# Altium project concentrator-868MHz.PrjPcb (part 1 of 2)
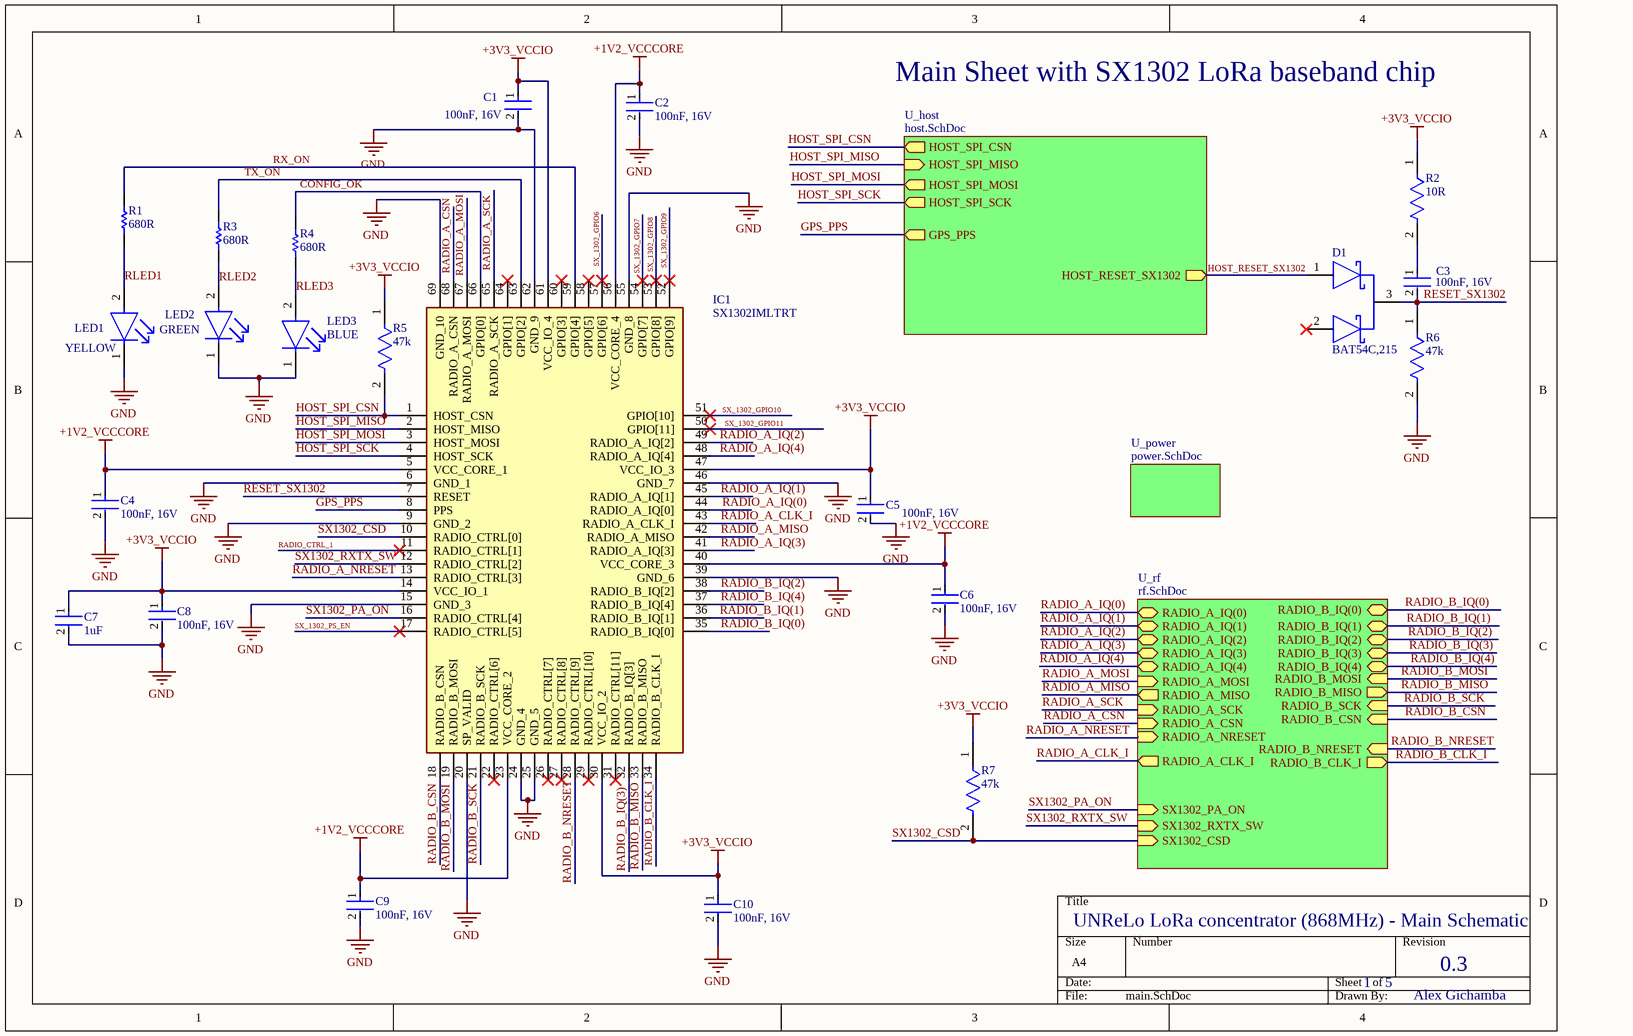
[diagram p0: main.SchDoc]
5 sheets, 112 parts. Net scope: hierarchical (ports join the sheet entries above them; power ports are global).
Board file: concentrator_pcb.PcbDoc
Sheets:
  main.SchDoc
    U_host = host.SchDoc
    U_rf = rf.SchDoc
      U_rf-fem = rf-fem.SchDoc
    U_power = power.SchDoc

## Sheet main.SchDoc
size A4; SheetNumber: 1; SheetTotal: 5

### Parts
C1  100nF, 16V  [FP-CC0603-DA-MFG]
C2  100nF, 16V  [FP-CC0603-DA-MFG]
C3  100nF, 16V  [FP-CC0603-DA-MFG]
C4  100nF, 16V  [FP-CC0603-DA-MFG]
C5  100nF, 16V  [FP-CC0603-DA-MFG]
C6  100nF, 16V  [FP-CC0603-DA-MFG]
C7  1uF  [FP-CL21-IPC_A]
C8  100nF, 16V  [FP-CC0603-DA-MFG]
C9  100nF, 16V  [FP-CC0603-DA-MFG]
C10  100nF, 16V  [FP-CC0603-DA-MFG]
D1  BAT54C,215  [FP-SOT23-MFG]
IC1  SX1302IMLTRT  [QFN35P700X700X80-69N-D]
LED1  YELLOW  [FP-SML-D12-MFG]
LED2  GREEN  [FP-LTST-C171GKT-MFG]
LED3  BLUE  [FP-6_541-5094_01-4-MFG]
R1  680R  [RESC2013X70X40ML20T20]
R2  10R  [FP-ERJ3EK-MFG]
R3  680R  [RESC2013X70X40ML20T20]
R4  680R  [RESC2013X70X40ML20T20]
R5  47k  [FP-RMCF0805-IPC_B]
R6  47k  [FP-RMCF0805-IPC_B]
R7  47k  [FP-RMCF0805-IPC_B]

### Sub-sheets
U_host = host.SchDoc: HOST_SPI_MOSI (out), HOST_SPI_MISO (in), HOST_SPI_CSN (out), HOST_SPI_SCK (out), HOST_RESET_SX1302 (out), GPS_PPS (out)
U_power = power.SchDoc: no entries
U_rf = rf.SchDoc: RADIO_A_IQ(0) (bidir), RADIO_A_IQ(1) (bidir), RADIO_A_IQ(4) (bidir), RADIO_A_IQ(3) (bidir), RADIO_A_IQ(2) (bidir), RADIO_B_IQ(2) (bidir), RADIO_B_IQ(4) (bidir), RADIO_B_IQ(1) (bidir), RADIO_B_IQ(0) (bidir), RADIO_B_IQ(3) (bidir), RADIO_A_SCK (in), RADIO_A_MOSI (in), RADIO_A_MISO (out), RADIO_A_NRESET (in), RADIO_A_CSN (in), RADIO_B_CSN (in), RADIO_B_SCK (in), RADIO_B_MOSI (in), RADIO_B_MISO (out), RADIO_B_NRESET (in), SX1302_CSD (in), SX1302_RXTX_SW (in), SX1302_PA_ON (in), RADIO_B_CLK_I (out), RADIO_A_CLK_I (out)

### Nets
+1V2_VCCCORE: C2.1 C4.1 C6.1 C9.1 IC1.5(VCC_CORE_1) IC1.23(VCC_CORE_2) IC1.40(VCC_CORE_3) IC1.56(VCC_CORE_4)
+3V3_VCCIO: C1.1 C5.1 C7.1 C8.1 C10.1 IC1.14(VCC_IO_1) IC1.30(VCC_IO_2) IC1.47(VCC_IO_3) IC1.61(VCC_IO_4) R2.1 R5.1 R7.1
GND: C1.2 C2.2 C4.2 C5.2 C6.2 C7.2 C8.2 C9.2 C10.2 IC1.6(GND_1) IC1.9(GND_2) IC1.15(GND_3) IC1.20(SP_VALID) IC1.24(GND_4) IC1.25(GND_5) IC1.39(GND_6) IC1.46(GND_7) IC1.55(GND_8) IC1.62(GND_9) IC1.69(GND_10) LED1.1(C) LED2.1(C) LED3.1(C) R6.2
CONFIG_OK: IC1.66(GPIO[0]) R4.2
GPS_PPS: IC1.8(PPS) ; sheet U_host/GPS_PPS
HOST_RESET_SX1302: D1.1(1_ANODE) ; sheet U_host/HOST_RESET_SX1302
HOST_SPI_CSN: IC1.1(HOST_CSN) R5.2 ; sheet U_host/HOST_SPI_CSN
HOST_SPI_MISO: IC1.2(HOST_MISO) ; sheet U_host/HOST_SPI_MISO
HOST_SPI_MOSI: IC1.3(HOST_MOSI) ; sheet U_host/HOST_SPI_MOSI
HOST_SPI_SCK: IC1.4(HOST_SCK) ; sheet U_host/HOST_SPI_SCK
RADIO_A_CLK_I: IC1.43(RADIO_A_CLK_I) ; sheet U_rf/RADIO_A_CLK_I
RADIO_A_CSN: IC1.68(RADIO_A_CSN) ; sheet U_rf/RADIO_A_CSN
RADIO_A_IQ(0): IC1.44(RADIO_A_IQ[0]) ; sheet U_rf/RADIO_A_IQ(0)
RADIO_A_IQ(1): IC1.45(RADIO_A_IQ[1]) ; sheet U_rf/RADIO_A_IQ(1)
RADIO_A_IQ(2): IC1.49(RADIO_A_IQ[2]) ; sheet U_rf/RADIO_A_IQ(2)
RADIO_A_IQ(3): IC1.41(RADIO_A_IQ[3]) ; sheet U_rf/RADIO_A_IQ(3)
RADIO_A_IQ(4): IC1.48(RADIO_A_IQ[4]) ; sheet U_rf/RADIO_A_IQ(4)
RADIO_A_MISO: IC1.42(RADIO_A_MISO) ; sheet U_rf/RADIO_A_MISO
RADIO_A_MOSI: IC1.67(RADIO_A_MOSI) ; sheet U_rf/RADIO_A_MOSI
RADIO_A_NRESET: IC1.13(RADIO_CTRL[3]) ; sheet U_rf/RADIO_A_NRESET
RADIO_A_SCK: IC1.65(RADIO_A_SCK) ; sheet U_rf/RADIO_A_SCK
RADIO_B_CLK_I: IC1.34(RADIO_B_CLK_I) ; sheet U_rf/RADIO_B_CLK_I
RADIO_B_CSN: IC1.18(RADIO_B_CSN) ; sheet U_rf/RADIO_B_CSN
RADIO_B_IQ(0): IC1.35(RADIO_B_IQ[0]) ; sheet U_rf/RADIO_B_IQ(0)
RADIO_B_IQ(1): IC1.36(RADIO_B_IQ[1]) ; sheet U_rf/RADIO_B_IQ(1)
RADIO_B_IQ(2): IC1.38(RADIO_B_IQ[2]) ; sheet U_rf/RADIO_B_IQ(2)
RADIO_B_IQ(3): IC1.32(RADIO_B_IQ[3]) ; sheet U_rf/RADIO_B_IQ(3)
RADIO_B_IQ(4): IC1.37(RADIO_B_IQ[4]) ; sheet U_rf/RADIO_B_IQ(4)
RADIO_B_MISO: IC1.33(RADIO_B_MISO) ; sheet U_rf/RADIO_B_MISO
RADIO_B_MOSI: IC1.19(RADIO_B_MOSI) ; sheet U_rf/RADIO_B_MOSI
RADIO_B_NRESET: IC1.28(RADIO_CTRL[9]) ; sheet U_rf/RADIO_B_NRESET
RADIO_B_SCK: IC1.21(RADIO_B_SCK) ; sheet U_rf/RADIO_B_SCK
RADIO_CTRL_1: IC1.11(RADIO_CTRL[1])
RESET_SX1302: C3.2 D1.3(COMMON_CATHODE) IC1.7(RESET) R6.1
RLED1: LED1.2(A) R1.1
RLED2: LED2.2(A) R3.1
RLED3: LED3.2(A) R4.1
RX_ON: IC1.59(GPIO[4]) R1.2
SX1302_CSD: IC1.10(RADIO_CTRL[0]) R7.2 ; sheet U_rf/SX1302_CSD
SX1302_PA_ON: IC1.16(RADIO_CTRL[4]) ; sheet U_rf/SX1302_PA_ON
SX1302_RXTX_SW: IC1.12(RADIO_CTRL[2]) ; sheet U_rf/SX1302_RXTX_SW
SX_1302_GPIO6: IC1.57(GPIO[6])
SX_1302_GPIO7: IC1.54(GPIO[7])
SX_1302_GPIO8: IC1.53(GPIO[8])
SX_1302_GPIO9: IC1.52(GPIO[9])
SX_1302_GPIO10: IC1.51(GPIO[10])
SX_1302_GPIO11: IC1.50(GPIO[11])
SX_1302_PS_EN: IC1.17(RADIO_CTRL[5])
TX_ON: IC1.63(GPIO[2]) R3.2
NetC3_1: C3.1 R2.2

Not connected (* = marked no-connect by the designer): D1 2(2_ANODE)*; IC1 22(RADIO_CTRL[6])* 26(RADIO_CTRL[7])* 27(RADIO_CTRL[8])* 29(RADIO_CTRL[10])* 31(RADIO_CTRL[11])* 58(GPIO[5])* 60(GPIO[3])* 64(GPIO[1])*

### Notes on the sheet
- Main Sheet with SX1302 LoRa baseband chip
- UNReLo LoRa concentrator (868MHz) - Main Schematic
- 1
- 5
- 0.3
- Alex Gichamba

### Library data of the parts
C1-C6 C8-C10 = CMP-2100-03601-2: CAP CER 0.1UF 50V X7R 0603; Manufacturer: YAGEO; Manufacturer Part Number: CC0603KRX7R9BB104; Material: Ceramic; Temperature Coefficient: 15%; Tolerance: 0.1; Height: 0.9mm; Voltage: 50 V; ComponentLink2Description: Datasheet; Device Class L2: Capacitors; Temperature Range High: +125°C; Category: Cap; Capacitance: 100 nF; Footprint Url: http://www.yageo.com/exep/pages/download/literatures/UPY-C_GEN_24.pdf; ComponentLink2URL: http://www.yageo.com/documents/recent/UPY-GPHC_X7R_6.3V-to-50V_18.pdf; Package: CC0603-DA; Temperature: -55°C to +125°C; Voltage Rating: 50 V; Temperature Characteristic: X7R; Device Class L1: Passive Components; Temperature Range Low: -55°C; RoHS: TRUE; Automotive: No; Value: 100 nF; Device Class L3: Ceramic Capacitors; Octopart: https://octopart.com/cc0603krx7r9bb104-yageo-42244635; Mouser Description: Multilayer Ceramic Capacitor, CC Series, 0.1 - F, - 10%, X7R, 50 V, 0603 [1608 Metric]; Lead Free: Yes; Digikey Description: CAP CER 0.1UF 50V X7R 0603
C7 = CMP-13271-003098-1: CL21 Series 0805 1uF 16V ±10% Tolerance X7R Multilayer Ceramic Chip Capacitor; Case Code (Metric): 2012; Width: 0.049inch; Thickness: 0.053inch; Voltage Rating: 16V; Max Operating Temperature: 125°C; Case Code (Imperial): 0805; Height: 1.25mm; Length: 2mm; Case/Package: 0805; Lead Free: Lead Free; Mount: Surface Mount; Capacitance: 1uF; Tolerance: 10%; Voltage Rating (DC): 16V; Min Operating Temperature: -55°C; Contact Plating: Tin; Depth: 1.25mm; Packaging: Tape and Reel; Package Quantity: 1; Voltage: 16V; Dielectric: X7R; Radiation Hardening: No
D1 = CMP-14398-000007-1: DIODE ARRAY SCHOTTKY 30V SOT23; Manufacturer: Nexperia; Automotive Grade: Grade 0; Peak Reverse Current: 2uA; Forward Current: 200mA; Max Surge Forward Current: 600mA; Value: 10pF; Max Junction Temp: +150°C; Lead Free: Yes; Automotive: Yes; Device Class L1: Discrete Semiconductors; Digikey Description: DIODE ARRAY SCHOTTKY 30V SOT23; Reverse Voltage: 30V; ComponentLink2URL: https://assets.nexperia.com/documents/data-sheet/BAT54_SER.pdf; Device Class L2: Diodes; Category: Diode; Octopart: https://octopart.com/bat54c%2C215-nexperia-78738945; Package: SOT23; Mouser Description: Schottky Diodes, Rectifiers - Arrays SOT-23 (TO-236AB) 30V 200mA (DC) Surface Mount; RoHS: TRUE; Manufacturer Part Number: BAT54C,215; Temperature: to +150°C; Ambient Temperature Range Low: -55°C; Height: 1.1mm; Device Class L3: Schottky Diodes; Temperature Range High: +150°C; Footprint Url: https://assets.nexperia.com/documents/outline-drawing/SOT23.pdf; Capacitance: 10pF; Ambient Temperature Range High: +150°C; Ipc Land Pattern Name: SOT95P230X100-3; ComponentLink2Description: Datasheet
IC1 = CMP-009-000004-1: Integrated Circuit; Manufacturer_Name: SEMTECH; Mouser Part Number: 947-SX1302IMLTRT; Datasheet Link: https://datasheet.datasheetarchive.com/originals/distributors/Datasheets_SAMA/c18cc298abe30af156b2783e16147acc.pdf; Design Item ID: SX1302IMLTRT; Mouser Price/Stock: https://www.mouser.co.uk/ProductDetail/Semtech/SX1302IMLTRT?qs=bZr6mbWTK5nALa%252B96PTK0Q%3D%3D; Height: 0.8mm; Component Type: Standard; Pin Count: 69; Source: SamacSys.SchLib; Manufacturer_Part_Number: SX1302IMLTRT
LED1 = CMP-08952-000005-1: LED YLW/GREEN DIFFUSED 1608 SMD; Manufacturer Part Number: SML-D12M1WT86; Manufacturer: Rohm; Led Orientation: Top View; Forward Voltage: 2.2V; Power Dissipation: 54mW; Wavelength: 572nm; Colour: Green; Reverse Voltage: 5V; Forward Current: 20mA; Luminous Intensity: 30mcd; RoHS: TRUE; Package: SML-D12; Temperature Range Low: -40°C; Device Class L3: unset; Temperature Range High: +85°C; Device Class L2: LEDs; Category: Diode; Device Class L1: Optoelectronics; Digikey Description: LED YLW/GREEN DIFFUSED 1608 SMD; Temperature: -40°C to +85°C; ComponentLink2Description: Datasheet; Automotive: No; Height: 0.65mm; Lead Free: Yes; Octopart: https://octopart.com/sml-d12m1wt86-rohm-70837112; ComponentLink2URL: https://www.rohm.com/datasheet/SML-D12M1W
LED2 = CMP-22017-000007-1: LED GREEN CLEAR CHIP SMD; Luminous Intensity: 12mcd; Lens Color: Colorless; Dominant Wavelength: 569nm; Number of LEDs: 1; Power Dissipation: 100mW; Viewing Angle: 130°; Reverse Voltage: 5V; Test Current: 10mA; Forward Voltage: 2.1V; Wavelength: 585nm; Lens Style: Diffused; Forward Current: 30mA; Height: 0.8mm; Mount: Surface Mount; Package Quantity: 1; Length: 2mm; Case Code (Metric): 2012; Number of Pins: 2; Number of Elements: 1; Packaging: Tape and Reel; Color: Green; Min Operating Temperature: -55°C; Case/Package: 0805; Power Rating: 100mW; Max Operating Temperature: 85°C; Radiation Hardening: No; Depth: 1.25mm; Lens Transparency: Clear; Width: 1.25mm; Lead Free: Lead Free; Case Code (Imperial): 0805; Illumination Color: Green
LED3 = CMP-02520-000013-1: LED BLUE 0603 SMD; Manufacturer Part Number: VLMB1300-GS08; Manufacturer: Vishay Semiconductor Opto Division; Forward Current: 20mA; Wavelength: 475nm; Viewing Angle: 130°; Forward Voltage: 3.8V; Power Dissipation: 76mW; Luminous Intensity: 28-180mcd; Led Orientation: Top View; Peak Emmision Wavelength: 468nm; RoHS: TRUE; ComponentLink2URL: http://www.vishay.com/docs/82437/vlmo1300.pdf; Ambient Temperature Range Low: -20°C; ComponentLink2Description: Datasheet; Mouser Description: LED; SMD; 0603; blue; 28-180mcd; 1.6x0.8x0.8mm; 130°; 2.8÷3.8V; 20mA; Package: 6.541-5094.01-4; Device Class L3: unset; Automotive: No; Temperature: -20°C to +80°C; Colour: Blue; Digikey Description: LED BLUE 0603 SMD; Device Class L2: LEDs; Temperature Range Low: -20°C; Lead Free: Yes; Category: Diode; Device Class L1: Optoelectronics; Height: 1mm; Octopart: https://octopart.com/vlmb1300-gs08-vishay-22022408; Temperature Range High: +80°C; Ambient Temperature Range High: +80°C
R1 R3 R4 = CMP-2001-00566-1: Part Number: ERJ6ENF6800V; Manufacturer: Panasonic
R2 = CMP-2000-00195-2: RES SMD 10 OHM 1% 1/10W 0603; Manufacturer Part Number: ERJ-3EKF10R0V; Manufacturer: Panasonic; Resistance: 10Ω; Voltage Rating: 75V; Value: 10Ω; Power: 100mW; Power Rating: 0.1W; Temperature Coefficient: 100ppm/°C; Automotive Grade: Grade 0; Lead Free: Yes; Device Class L1: Passive Components; Digikey Description: RES SMD 10 OHM 1% 1/10W 0603; Octopart: https://octopart.com/erj-3ekf10r0v-panasonic-55403649; Automotive: Yes; ComponentLink2URL: https://b2b-api.panasonic.eu/file_stream/pids/fileversion/1263; Height: 0.55mm; Temperature Range High: +155°C; Footprint Url: https://industrial.panasonic.com/cdbs/www-data/pdf/RDA0000/DMA0000COL17.pdf; Temperature: -55°C to +155°C; Tolerance: 1%; ComponentLink2Description: Datasheet; Package: ERJ3EK; Device Class L2: Resistors; Category: Res; Ipc Land Pattern Name: RESC16080X45; RoHS: TRUE; Composition: Thick Film; Device Class L3: Chip SMD Resistors; Temperature Range Low: -55°C; Series: ERJ
R5-R7 = CMP-26527-006464-1: 47kΩ ±5% 0.125W 0805 Thick Film Chip Resistor AEC-Q200 compliant; Power Rating: 125mW; Working Voltage: 150V; Temperature Coefficient: 100ppm/°C; Resistance: 47kR; Length: 2mm; Max Operating Temperature: 155°C; Case Code (Imperial): 0805; Min Operating Temperature: -55°C; Radiation Hardening: No; Tolerance: 5%; Number of Terminations: 2; Technology: THICK FILM; Military Standard: Not; Max Power Dissipation: 125mW; RoHS Compliant: Yes; Case/Package: 0805; Mount: Surface Mount; Resistor Type: Thick Film; Packaging: Tape and Reel; Lead Free: Lead Free; Depth: 1.25mm; Width: 0.049inch; Case Code (Metric): 2012; Height: 0.026inch; Contact Plating: Tin; Construction: Rectangular; Series: RMCF; Features: Automotive AEC-Q200

## Sheet host.SchDoc
size A4; SheetNumber: 4; SheetTotal: 5
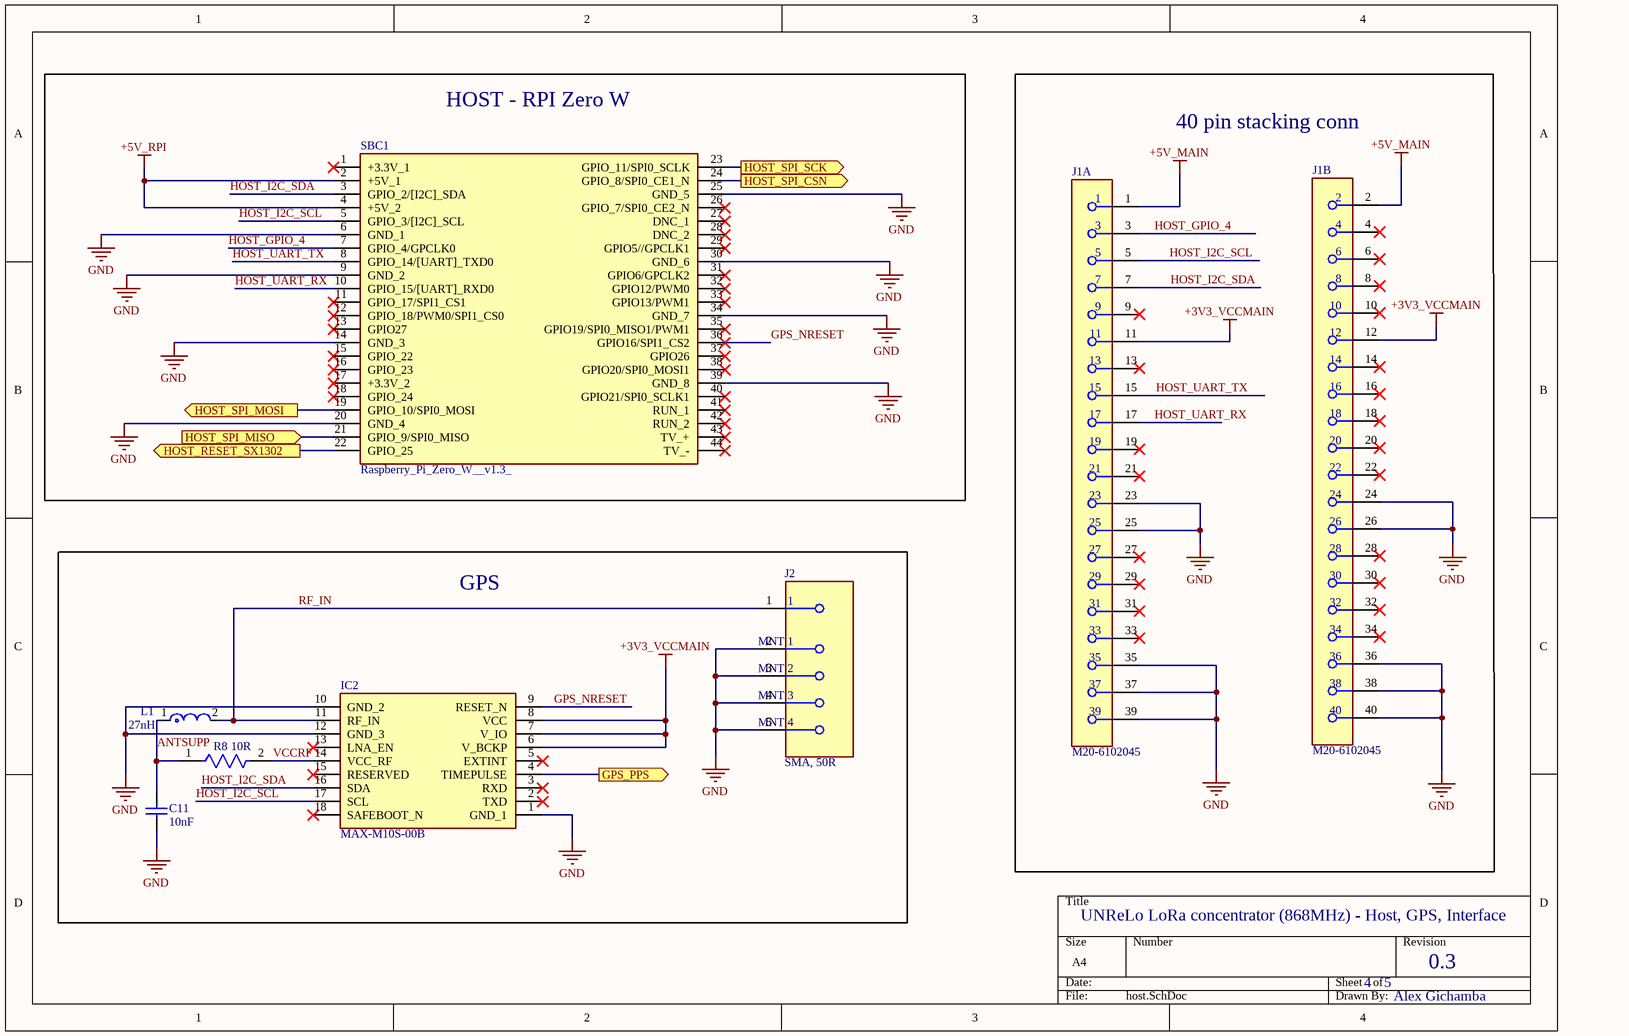
[diagram p1: host.SchDoc]

### Parts
C11  10nF  [CAPC1608X90X35NL15T15]
IC2  MAX-M10S-00B  [MAXM10S00B]
J1  M20-6102045  [FP-M20-6102045-MFG]  (parts A,B of 2)
J2  SMA, 50R  [FP-SMA-J-P-H-ST-EM1-MFG]
L1  27nH  [FP-LQG15HH_02-IPC_C]
R8  10R  [FP-ERJ3EK-MFG]
SBC1  Raspberry_Pi_Zero_W__v1.3_  [RASPBERRYPIZEROWV13]

### Blocks framed on the sheet
HOST - RPI Zero W: SBC1
40 pin stacking conn: J1
GPS: C11 IC2 J2 L1 R8

### Ports
GPS_PPS (out), HOST_RESET_SX1302 (out), HOST_SPI_CSN (out), HOST_SPI_MISO (in), HOST_SPI_MOSI (out), HOST_SPI_SCK (out)

### Nets
+3V3_VCCMAIN: IC2.6(V_BCKP) IC2.7(V_IO) IC2.8(VCC) J1.11 J1.12
+5V_MAIN: J1.1 J1.2
+5V_RPI: SBC1.2(+5V_1) SBC1.4(+5V_2)
GND: C11.1 IC2.1(GND_1) IC2.10(GND_2) IC2.12(GND_3) J1.23 J1.24 J1.25 J1.26 J1.35 J1.36 J1.37 J1.38 J1.39 J1.40 J2.2(MNT_1) J2.3(MNT_2) J2.4(MNT_3) J2.5(MNT_4) SBC1.6(GND_1) SBC1.9(GND_2) SBC1.14(GND_3) SBC1.20(GND_4) SBC1.25(GND_5) SBC1.30(GND_6) SBC1.34(GND_7) SBC1.39(GND_8)
ANTSUPP: C11.2 L1.1 R8.1
GPS_NRESET: IC2.9(RESET_N) SBC1.36(GPIO16/SPI1_CS2)
GPS_PPS: IC2.4(TIMEPULSE) ; port GPS_PPS
HOST_GPIO_4: J1.3 SBC1.7(GPIO_4/GPCLK0)
HOST_I2C_SCL: IC2.17(SCL) J1.5 SBC1.5(GPIO_3/[I2C]_SCL)
HOST_I2C_SDA: IC2.16(SDA) J1.7 SBC1.3(GPIO_2/[I2C]_SDA)
HOST_RESET_SX1302: SBC1.22(GPIO_25) ; port HOST_RESET_SX1302
HOST_SPI_CSN: SBC1.24(GPIO_8/SPI0_CE1_N) ; port HOST_SPI_CSN
HOST_SPI_MISO: SBC1.21(GPIO_9/SPI0_MISO) ; port HOST_SPI_MISO
HOST_SPI_MOSI: SBC1.19(GPIO_10/SPI0_MOSI) ; port HOST_SPI_MOSI
HOST_SPI_SCK: SBC1.23(GPIO_11/SPI0_SCLK) ; port HOST_SPI_SCK
HOST_UART_RX: J1.17 SBC1.10(GPIO_15/[UART]_RXD0)
HOST_UART_TX: J1.15 SBC1.8(GPIO_14/[UART]_TXD0)
RF_IN: IC2.11(RF_IN) J2.1 L1.2
VCCRF: IC2.14(VCC_RF) R8.2

Not connected (* = marked no-connect by the designer): IC2 2(TXD)* 3(RXD)* 5(EXTINT)* 13(LNA_EN)* 15(RESERVED)* 18(SAFEBOOT_N)*; J1 4* 6* 8* 9* 10* 13* 14* 16* 18* 19* 20* 21* 22* 27* 28* 29* 30* 31* 32* 33* 34*; SBC1 1(+3.3V_1)* 11(GPIO_17/SPI1_CS1)* 12(GPIO_18/PWM0/SPI1_CS0)* 13(GPIO27)* 15(GPIO_22)* 16(GPIO_23)* 17(+3.3V_2)* 18(GPIO_24)* 26(GPIO_7/SPI0_CE2_N)* 27(DNC_1)* 28(DNC_2)* 29(GPIO5//GPCLK1)* 31(GPIO6/GPCLK2)* 32(GPIO12/PWM0)* 33(GPIO13/PWM1)* 35(GPIO19/SPI0_MISO1/PWM1)* 37(GPIO26)* 38(GPIO20/SPI0_MOSI1)* 40(GPIO21/SPI0_SCLK1)* 41(RUN_1)* 42(RUN_2)* 43(TV_+)* 44(TV_-)*

### Notes on the sheet
- UNReLo LoRa concentrator (868MHz) - Host, GPS, Interface
- 4
- 5
- 0.3
- Alex Gichamba

### Library data of the parts
C11 = CMP-2006-02084-1: Manufacturer: AVX Interconnect / Elco; Part Number: 0603YC103JAT2A
IC2 = MAX-M10S-00B: Integrated Circuit; Manufacturer_Name: U-Blox; Datasheet Link: https://content.u-blox.com/sites/default/files/MAX-M10S_IntegrationManual_UBX-20053088.pdf; Height: 2.7mm; Manufacturer_Part_Number: MAX-M10S-00B; Mouser Part Number: 377-MAX-M10S-00B; Mouser Price/Stock: https://www.mouser.co.uk/ProductDetail/u-blox/MAX-M10S-00B?qs=A6eO%252BMLsxmT0PfQYPb7LLQ%3D%3D
J1 = CMP-15831-000080-1: CONN STKTHRU PC/104 40POS PCB; Current Rating: 3A; Pitch: 2.54mm; Insulation Resistance: 5GR; Contact Resistance: 30mR; Number of Positions: 40; Gender: Receptacle; REACH SVHC: No SVHC; Housing Material: Nylon; Number of Rows: 2; Min Operating Temperature: -55°C; Contact Plating: Gold; Orientation: Straight; Mount: Through Hole; Contact Material: Bronze; Length: 51.46mm; Weight: 0.218205oz; Number of Contacts: 40; Packaging: Rail/Tube; Depth: 5.25mm; Termination: Solder; Radiation Hardening: No; Flammability Rating: UL94 V-0; Housing Color: Black; Max Operating Temperature: 105°C; Material: Nylon; Package Quantity: 11; Color: Black; Max Current Rating: 3A; Series: M20
J2 = CMP-02754-000006-1: CONN SMA JACK STR 50OHM EDGE MNT; Dielectric Material: PTFE; Center Contact Plating: Gold; Max Frequency: 6GHz; Body Material: Brass; Voltage Rating: 335V; Package Quantity: 1; Case/Package: SMA; Max Operating Temperature: 125°C; Fastening Type: Threaded; Orientation: Straight; Depth: 13.33mm; RoHS Compliant: Yes; Length: 6.35mm; Insulation Material: Polytetrafluoroethylene; Termination: Solder; Min Operating Temperature: -65°C; Housing Color: Gold; Impedance: 50R; Contact Plating: Gold; Contact Material: Copper; Connector Type: SMA; Mount: Edge; Series: SMA; Packaging: Tray; Body Plating: Gold; Radiation Hardening: No
L1 = CMP-2000-06578-2: Multilayer type RF Inductor 27nH ±5% 0.46Ω 350mA 0402; DC Current: 300mA; Core Material: Air; Self Resonant Frequency: 1.7GHz; Q Factor: 8; DC Resistance (DCR): 460mR; Shielding: Unshielded; Test Frequency: 100MHz; Inductance: 27nH; Width: 0.02inch; Length: 1mm; Height - Seated (Max): 0.022inch; Military Standard: Not; Case Code (Imperial): 0402; Tolerance: 5%; Depth: 0.55mm; Current Rating: 300mA; Inductance Tolerance: 5%; Lead Free: Lead Free; Height: 0.5mm; Max DC Current: 300mA; REACH SVHC: No SVHC; Package Quantity: 10000; Mount: Surface Mount; Termination: SMD/SMT; Case Code (Metric): 1005; Case/Package: 0402; Max Operating Temperature: 125°C; Packaging: Tape and Reel; Min Operating Temperature: -55°C
R8 = CMP-2000-00195-2: as R2 on sheet main; Lead Free: Yes; Device Class L1: Passive Components; Digikey Description: RES SMD 10 OHM 1% 1/10W 0603; Octopart: https://octopart.com/erj-3ekf10r0v-panasonic-55403649; Automotive: Yes; ComponentLink2URL: https://b2b-api.panasonic.eu/file_stream/pids/fileversion/1263; Height: 0.55mm; Temperature Range High: +155°C; Footprint Url: https://industrial.panasonic.com/cdbs/www-data/pdf/RDA0000/DMA0000COL17.pdf; Temperature: -55°C to +155°C; Tolerance: 1%; ComponentLink2Description: Datasheet; Package: ERJ3EK; Device Class L2: Resistors; Category: Res; Ipc Land Pattern Name: RESC16080X45; RoHS: TRUE; Composition: Thick Film; Device Class L3: Chip SMD Resistors; Temperature Range Low: -55°C; Series: ERJ
SBC1 = Raspberry_Pi_Zero_W__v1.3_: Integrated Circuit; Manufacturer_Name: RASPBERRY-PI; Manufacturer_Part_Number: Raspberry Pi Zero W (v1.3); Datasheet Link: https://cdn.sparkfun.com/assets/learn_tutorials/6/7/6/PiZero_1.pdf

## Sheet rf.SchDoc
size A4; SheetNumber: 2; SheetTotal: 5; SPICEModelCacheDZKFQWXO: <root> / <DocumentId>DZKFQWXO</DocumentId> / <CacheFrame Number="0"> / <Model Name="gmk107b7474_aht" Kind="CKT"> / <Text>* GMK107B7474_AHT     SPICE MODEL  ( General Type ) / *-------------------------------------------------------------------------------------------------------- / * Model Generated by TAIYO YUDEN Corporation (http://www.ty-top.com) / * Version 1.0 / * TAIYO YUDEN Control No. 170508_121019 / * Copyright(c) 2012 TAIYO YUDEN CO.,LTD. All Rights Reserved. / *-------------------------------------------------------------------------------------------------------- / * / * Products Name : Multilayer Ceramic Capacitors / * / * Characteristics : / *     Capacitance : 0.47 uF , Rated Voltage : 35V , TCC : X7R / *     Case Size : 1.6 x 0.8 / 0.063 x 0.031 [mm/inch] , Thickness : 0.8 / 0.031 [mm/inch] / *     (Conditions: Temperature = 25 degC , DC Bias Current/Voltage = 0A / 0V) / * / * Frequency Range : 40Hz - 3GHz / * / * External Node Assignments : / * / *  1  o---| |---o  2 / * / *-------------------------------------------------------------------------------------------------------- / .SubCkt GMK107B7474_AHT 1 2 / **************************** / C0 1 110 0.35241u / Cm 1 101 0.045967u / C1 101 102 0.1128u / Rc1 101 102 7.0157k / C2 102 103 0.052259u / Rc2 102 103 650.62 / C3 103 110 0.038908u / Rc3 103 110 33.924 / C2m 1 301 0.059177u / C21 301 302 0.20596u / Rc21 301 302 18.494k / C22 302 303 0.3392u / Rc22 302 303 11.168k / C23 303 304 0.29488u / Rc23 303 304 12.333k / C24 304 305 0.15174u / Rc24 304 305 1.1874k / C25 305 306 0.15169u / Rc25 305 306 1.0968k / C26 306 307 0.081575u / Rc26 306 307 73.58 / C27 307 308 0.067021u / Rc27 307 308 74.754 / C28 308 309 0.057362u / Rc28 308 309 86.716 / C29 309 110 3917.4p / Rc29 309 110 14.273 / Rp0 1 110 1.06382978723404G / L0 110 120 0.25665n / Lm 120 130 0.18492n / L1 120 121 0.15921n / RL1 121 130 0.10518 / L2 120 122 1.1975n / RL2 122 130 0.76936 / L3 120 123 2.5752n / RL3 123 130 1.6537 / CR 120 124 0.034572u / LR 124 125 0.3441n / RR 125 130 93.45m / CL 130 140 1.8662p / LL 130 140 0.25845n / RL 130 140 37.948 / Rs 140 2 10.204m / **************************** / .ends GMK107B7474_AHT</Text> / </Model> / </CacheFrame> / </root>
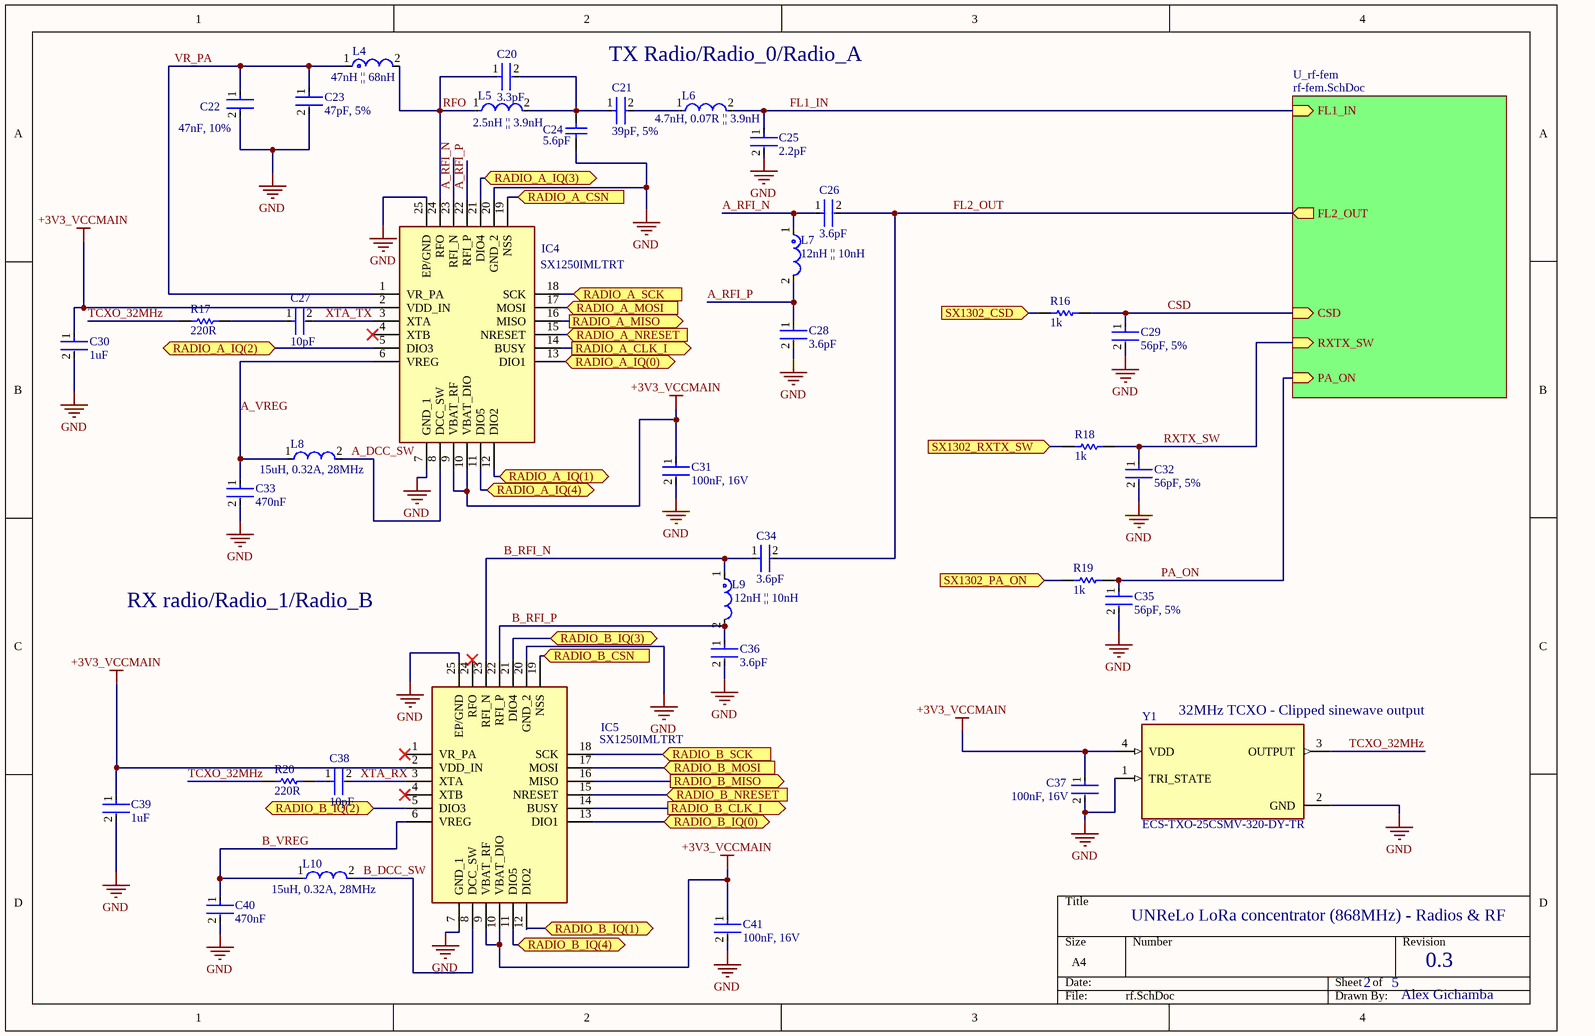
[diagram p2: rf.SchDoc]

### Parts
C20  3.3pF  [FP-GQM187-0_15-MFG]
C21  39pF, 5%  [FP-CL10-IPC_B]
C22  47nF, 10%  [FP-CL10-IPC_A]
C23  47pF, 5%  [FP-0603-L_1_6_0_15-W_0_81-MFG]
C24  5.6pF  [CAPC1608X90X35ML10T15]
C25  2.2pF  [FP-CL764-IPC_C]
C26  3.6pF  [FP-GJM155-0_05-IPC_C]
C27  10pF  [FP-CL10-IPC_A]
C28  3.6pF  [FP-GJM155-0_05-IPC_C]
C29  56pF, 5%  [FP-GCM188-0_1-IPC_A]
C30  1uF  [FP-CL21-IPC_A]
C31  100nF, 16V  [FP-CC0603-DA-MFG]
C32  56pF, 5%  [FP-GCM188-0_1-IPC_A]
C33  470nF  [FP-0603-L_1_6_0_1-W_0_8_0-IPC_A]
C34  3.6pF  [FP-GJM155-0_05-IPC_C]
C35  56pF, 5%  [FP-GCM188-0_1-IPC_A]
C36  3.6pF  [FP-GJM155-0_05-IPC_C]
C37  100nF, 16V  [FP-CC0603-DA-MFG]
C38  10pF  [FP-CL10-IPC_A]
C39  1uF  [FP-CL21-IPC_A]
C40  470nF  [FP-0603-L_1_6_0_1-W_0_8_0-IPC_A]
C41  100nF, 16V  [FP-CC0603-DA-MFG]
IC4  SX1250IMLTRT  [QFN50P400X400X100-25N-D]
IC5  SX1250IMLTRT  [QFN50P400X400X100-25N-D]
L4  47nH || 68nH  [FP-LQG18HH_00-MFG]
L5  2.5nH || 3.9nH  [FP-LQW15AN_00-W0_6-0_1-MFG]
L6  4.7nH, 0.07R || 3.9nH  [FP-LQW15AN_00-W0_6-0_1-MFG]
L7  12nH || 10nH  [FP-LQG15HH_02-IPC_A]
L8  15uH, 0.32A, 28MHz  [FP-CB2012-MFG]
L9  12nH || 10nH  [FP-LQG15HH_02-IPC_A]
L10  15uH, 0.32A, 28MHz  [FP-CB2012-MFG]
R16  1k  [RESC2013X70X40ML20T20]
R17  220R  [RESC1608X55X30LL15T15]
R18  1k  [RESC2013X70X40ML20T20]
R19  1k  [RESC2013X70X40ML20T20]
R20  220R  [RESC1608X55X30LL15T15]
Y1  ECS-TXO-25CSMV-320-DY-TR  [OSC_ECS-TXO-25CSMV-320-DY-TR]

### Sub-sheets
U_rf-fem = rf-fem.SchDoc: CSD (in), PA_ON (in), RXTX_SW (in), FL1_IN (in), FL2_OUT (out)

### Ports
RADIO_A_CLK_I (out), RADIO_A_CSN (in), RADIO_A_IQ(0) (bidir), RADIO_A_IQ(1) (bidir), RADIO_A_IQ(2) (bidir), RADIO_A_IQ(3) (bidir), RADIO_A_IQ(4) (bidir), RADIO_A_MISO (out), RADIO_A_MOSI (in), RADIO_A_NRESET (in), RADIO_A_SCK (in), RADIO_B_CLK_I (out), RADIO_B_CSN (in), RADIO_B_IQ(0) (bidir), RADIO_B_IQ(1) (bidir), RADIO_B_IQ(2) (bidir), RADIO_B_IQ(3) (bidir), RADIO_B_IQ(4) (bidir), RADIO_B_MISO (out), RADIO_B_MOSI (in), RADIO_B_NRESET (in), RADIO_B_SCK (in), SX1302_CSD (in), SX1302_PA_ON (in), SX1302_RXTX_SW (in)

### Nets
+3V3_VCCMAIN: C30.1 C31.1 C37.1 C39.1 C41.1 IC4.2(VDD_IN) IC4.9(VBAT_RF) IC4.10(VBAT_DIO) IC5.2(VDD_IN) IC5.9(VBAT_RF) IC5.10(VBAT_DIO) Y1.4(VDD)
GND: C22.2 C23.2 C24.1 C25.2 C28.2 C29.2 C30.2 C31.2 C32.2 C33.2 C35.2 C36.2 C37.2 C39.2 C40.2 C41.2 IC4.7(GND_1) IC4.20(GND_2) IC4.25(EP/GND) IC5.7(GND_1) IC5.20(GND_2) IC5.25(EP/GND) Y1.1(TRI_STATE) Y1.2(GND)
A_DCC_SW: IC4.8(DCC_SW) L8.2
A_RFI_N: C26.1 IC4.23(RFI_N) L7.1
A_RFI_P: C28.1 IC4.22(RFI_P) L7.2
A_VREG: C33.1 IC4.6(VREG) L8.1
B_DCC_SW: IC5.8(DCC_SW) L10.2
B_RFI_N: C34.1 IC5.23(RFI_N) L9.1
B_RFI_P: C36.1 IC5.22(RFI_P) L9.2
B_VREG: C40.1 IC5.6(VREG) L10.1
CSD: C29.1 R16.2 ; sheet U_rf-fem/CSD
FL1_IN: C25.1 L6.2 ; sheet U_rf-fem/FL1_IN
FL2_OUT: C26.2 C34.2 ; sheet U_rf-fem/FL2_OUT
PA_ON: C35.1 R19.2 ; sheet U_rf-fem/PA_ON
RADIO_A_CLK_I: IC4.14(BUSY) ; port RADIO_A_CLK_I
RADIO_A_CSN: IC4.19(NSS) ; port RADIO_A_CSN
RADIO_A_IQ(0): IC4.13(DIO1) ; port RADIO_A_IQ(0)
RADIO_A_IQ(1): IC4.12(DIO2) ; port RADIO_A_IQ(1)
RADIO_A_IQ(2): IC4.5(DIO3) ; port RADIO_A_IQ(2)
RADIO_A_IQ(3): IC4.21(DIO4) ; port RADIO_A_IQ(3)
RADIO_A_IQ(4): IC4.11(DIO5) ; port RADIO_A_IQ(4)
RADIO_A_MISO: IC4.16(MISO) ; port RADIO_A_MISO
RADIO_A_MOSI: IC4.17(MOSI) ; port RADIO_A_MOSI
RADIO_A_NRESET: IC4.15(NRESET) ; port RADIO_A_NRESET
RADIO_A_SCK: IC4.18(SCK) ; port RADIO_A_SCK
RADIO_B_CLK_I: IC5.14(BUSY) ; port RADIO_B_CLK_I
RADIO_B_CSN: IC5.19(NSS) ; port RADIO_B_CSN
RADIO_B_IQ(0): IC5.13(DIO1) ; port RADIO_B_IQ(0)
RADIO_B_IQ(1): IC5.12(DIO2) ; port RADIO_B_IQ(1)
RADIO_B_IQ(2): IC5.5(DIO3) ; port RADIO_B_IQ(2)
RADIO_B_IQ(3): IC5.21(DIO4) ; port RADIO_B_IQ(3)
RADIO_B_IQ(4): IC5.11(DIO5) ; port RADIO_B_IQ(4)
RADIO_B_MISO: IC5.16(MISO) ; port RADIO_B_MISO
RADIO_B_MOSI: IC5.17(MOSI) ; port RADIO_B_MOSI
RADIO_B_NRESET: IC5.15(NRESET) ; port RADIO_B_NRESET
RADIO_B_SCK: IC5.18(SCK) ; port RADIO_B_SCK
RFO: C20.1 IC4.24(RFO) L4.2 L5.1
RXTX_SW: C32.1 R18.2 ; sheet U_rf-fem/RXTX_SW
SX1302_CSD: R16.1 ; port SX1302_CSD
SX1302_PA_ON: R19.1 ; port SX1302_PA_ON
SX1302_RXTX_SW: R18.1 ; port SX1302_RXTX_SW
TCXO_32MHz: R17.1 R20.1 Y1.3(OUTPUT)
VR_PA: C22.1 C23.1 IC4.1(VR_PA) L4.1
XTA_RX: C38.2 IC5.3(XTA)
XTA_TX: C27.2 IC4.3(XTA)
NetC20_2: C20.2 C21.1 C24.2 L5.2
NetC21_2: C21.2 L6.1
NetC27_1: C27.1 R17.2
NetC38_1: C38.1 R20.2

Not connected (* = marked no-connect by the designer): IC4 4(XTB)*; IC5 1(VR_PA)* 4(XTB)* 24(RFO)*

### Notes on the sheet
- TX Radio/Radio_0/Radio_A
- RX radio/Radio_1/Radio_B
- (near Y1) 32MHz TCXO - Clipped sinewave output
- UNReLo LoRa concentrator (868MHz) - Radios & RF
- 2
- 5
- 0.3
- Alex Gichamba

### Library data of the parts
C20 = CMP-2006-03899-2: Ceramic Capacitor 3.3pF ±0.1pF 250VDC C0G 0603 Paper T/R; Voltage Rating: 250V; Max Operating Temperature: 125°C; Case Code (Imperial): 0603; Depth: 0.8mm; Width: 0.8mm; Package Quantity: 4000; Height: 0.7mm; Case Code (Metric): 1608; Case/Package: 0603; Radiation Hardening: No; Min Operating Temperature: -55°C; Thickness: 0.031inch; Dielectric: C0G; Length: 1.6mm; Mount: Surface Mount; Packaging: Tape and Reel; Termination: SMD/SMT; Voltage Rating (DC): 250V; Capacitance: 3.3pF
C21 = CMP-13271-000028-1: Cap Ceramic 39pF 50V C0G ±5% Pad SMD 0603 +125°C T/R; Temperature Coefficient: 300ppm/°C; Depth: 0.8mm; Contact Plating: Tin; Tolerance: 5%; Thickness: 0.035inch; Mount: Surface Mount; Packaging: Tape and Reel; Min Operating Temperature: -55°C; Package Quantity: 1; Height: 0.8mm; Voltage: 50V; Dielectric: C0G; Radiation Hardening: No; Case Code (Metric): 1608; Max Operating Temperature: 125°C; Case/Package: 0603; Length: 1.6mm; Width: 0.031inch; Material: Ceramic; Capacitance: 39pF; Voltage Rating: 50V; Case Code (Imperial): 0603
C22 = CMP-13271-001056-1: Cap Ceramic 47nF 50V X7R ±10% Pad SMD 0603 +125°C T/R; Dielectric: Y5V; Packaging: Tape and Reel; Material: Ceramic; Max Operating Temperature: 125°C; Case/Package: 0603; Voltage Rating: 50V; Tolerance: 10%; Voltage: 50V; Height: 0.8mm; Capacitance: 47nF; Mount: Surface Mount; Min Operating Temperature: -55°C; Package Quantity: 4000; Length: 1.6mm; Depth: 0.8mm; Lead Free: Lead Free; Case Code (Metric): 1608; Width: 0.031inch; Thickness: 0.035inch; Case Code (Imperial): 0603; Radiation Hardening: No; Voltage Rating (DC): 50V; Contact Plating: Tin
C23 = CMP-2006-04316-2: General Purpose Ceramic Capacitor, 0603, 47pF, 5%, NP0, 30ppm/°C, 50V; Dielectric: C0G; Number of Pins: 2; REACH SVHC: No SVHC; Height: 0.9mm; Max Operating Temperature: 125°C; Voltage Rating: 50V; Thickness: 0.035inch; Temperature Coefficient: 30ppm/°C; Tolerance: 5%; Termination: SMD/SMT; Length: 1.6mm; Case/Package: 0603; Depth: 0.81mm; Min Operating Temperature: -55°C; Capacitance: 47pF; Contact Plating: Tin; Voltage Rating (DC): 50V; Case Code (Metric): 1608; Packaging: Tape and Reel; RoHS Compliant: Yes; Radiation Hardening: No; Width: 0.032inch; Voltage: 50V; Mount: Surface Mount; Case Code (Imperial): 0603; Package Quantity: 1; Lead Free: Lead Free
C24 = CMP-2006-02546-1: Manufacturer: Murata; Part Number: GRM1885C1H5R6BA01D
C25 = CMP-13271-003461-1: Cap Ceramic 2.2pF 50V C0G ±0.1pF SMD 0402 +125°C Paper T/R; Temperature Coefficient: 300ppm/°C; Width: 0.02inch; Packaging: Tape and Reel; Length: 1mm; Package Quantity: 1; Depth: 0.5mm; Radiation Hardening: No; Dielectric: C0G; Case/Package: 0402; Capacitance: 2.2pF; Lead Free: Lead Free; Min Operating Temperature: -55°C; Case Code (Imperial): 0402; Max Operating Temperature: 125°C; Case Code (Metric): 1005; Voltage Rating (DC): 50V; Thickness: 0.022inch; Mount: Surface Mount; Voltage: 50V; Height: 0.5mm; Voltage Rating: 50V
C26 C28 C34 C36 = CMP-2008-03849-2: Multi-Layer Ceramic Capacitor 3.6pF C0G  ±0.1pF 0402 Paper T/R; Voltage Rating (DC): 50V; Height: 0.5mm; Dielectric: C0G; Case Code (Metric): 1005; Mount: Surface Mount; Radiation Hardening: No; Length: 1mm; Case/Package: 0402; Packaging: Tape and Reel; Max Operating Temperature: 125°C; Lead Free: Lead Free; Min Operating Temperature: -55°C; Voltage Rating: 50V; Package Quantity: 10000; Termination: SMD/SMT; Depth: 0.5mm; Width: 0.5mm; Thickness: 0.022inch; Case Code (Imperial): 0402; Capacitance: 3.6pF
C27 C38 = CMP-13271-001725-1: Cap Ceramic 10pF 50V C0G ±5% Pad SMD 0603 +125°C T/R; Temperature Coefficient: 300ppm/°C; Packaging: Tape and Reel; Voltage: 50V; Lead Free: Lead Free; Voltage Rating: 50V; Dielectric: C0G; Package Quantity: 10000; Depth: 0.8mm; Mount: Surface Mount; Capacitance: 10pF; Thickness: 0.035inch; Tolerance: 5%; Length: 1.6mm; Voltage Rating (DC): 50V; Width: 0.031inch; Radiation Hardening: No; Max Operating Temperature: 125°C; Case/Package: 0603; Height: 0.8mm; Min Operating Temperature: -55°C
C29 C32 C35 = CMP-06035-013037-1: Ceramic Capacitor for Automotive 56pF  ±5% 100VDC C0G 0603 Paper T/R; Voltage Rating: 100V; Max Operating Temperature: 125°C; Packaging: Tape and Reel; Depth: 0.8mm; Mount: Surface Mount; Case Code (Imperial): 0603; Length: 1.6mm; Case Code (Metric): 1608; Capacitance: 56pF; Case/Package: 0603; Width: 0.8mm; Termination: SMD/SMT; Dielectric: C0G; Radiation Hardening: No; Tolerance: 5%; Package Quantity: 4000; Thickness: 0.035inch; Ratings: AEC-Q200; Min Operating Temperature: -25°C; Height: 0.8mm; Voltage Rating (DC): 100V
C30 C39 = CMP-13271-003098-1: as C7 on sheet main; Case Code (Metric): 2012; Width: 0.049inch; Thickness: 0.053inch; Voltage Rating: 16V; Max Operating Temperature: 125°C; Case Code (Imperial): 0805; Height: 1.25mm; Length: 2mm; Case/Package: 0805; Lead Free: Lead Free; Mount: Surface Mount; Capacitance: 1uF; Tolerance: 10%; Voltage Rating (DC): 16V; Min Operating Temperature: -55°C; Contact Plating: Tin; Depth: 1.25mm; Packaging: Tape and Reel; Package Quantity: 1; Voltage: 16V; Dielectric: X7R; Radiation Hardening: No
C31 C37 C41 = CMP-2100-03601-2: as C1 on sheet main; Height: 0.9mm; Voltage: 50 V; ComponentLink2Description: Datasheet; Device Class L2: Capacitors; Temperature Range High: +125°C; Category: Cap; Capacitance: 100 nF; Footprint Url: http://www.yageo.com/exep/pages/download/literatures/UPY-C_GEN_24.pdf; ComponentLink2URL: http://www.yageo.com/documents/recent/UPY-GPHC_X7R_6.3V-to-50V_18.pdf; Package: CC0603-DA; Temperature: -55°C to +125°C; Voltage Rating: 50 V; Temperature Characteristic: X7R; Device Class L1: Passive Components; Temperature Range Low: -55°C; RoHS: TRUE; Automotive: No; Value: 100 nF; Device Class L3: Ceramic Capacitors; Octopart: https://octopart.com/cc0603krx7r9bb104-yageo-42244635; Mouser Description: Multilayer Ceramic Capacitor, CC Series, 0.1 - F, - 10%, X7R, 50 V, 0603 [1608 Metric]; Lead Free: Yes; Digikey Description: CAP CER 0.1UF 50V X7R 0603
C33 C40 = CMP-14477-002264-2: None; Dielectric: X7R; Voltage Rating (DC): 35V; Tolerance: 10%; Min Operating Temperature: -55°C; Package Quantity: 1; Termination: SMD/SMT; Case Code (Imperial): 0603; Case Code (Metric): 1608; Thickness: 0.035inch; Halogen Free: Halogen Free; RoHS Compliant: Yes; Ratings: AEC-Q200; Height: 0.8mm; Case/Package: 0603; Packaging: Tape and Reel; Capacitance: 470nF; Voltage Rating: 35V; Lead Free: Lead Free; Width: 0.031inch; Mount: Surface Mount; Length: 0.063inch; Max Operating Temperature: 125°C
IC4 IC5 = SX1250IMLTRT: Integrated Circuit; Manufacturer_Name: SEMTECH; Datasheet Link: https://componentsearchengine.com/Datasheets/1/SX1250IMLTRT.pdf; Height: 1mm; Manufacturer_Part_Number: SX1250IMLTRT; Mouser Part Number: 947-SX1250IMLTRT; Mouser Price/Stock: https://www.mouser.co.uk/ProductDetail/Semtech/SX1250IMLTRT?qs=bZr6mbWTK5l3tz86ZAy1ig%3D%3D; Arrow Part Number: SX1250IMLTRT; Arrow Price/Stock: https://www.arrow.com/en/products/sx1250imltrt/semtech?region=nac
L4 = CMP-06042-006563-1: Multilayer type RF Inductor 68nH ±5% 0.8Ω 400mA 0603; Core Material: Air; DC Current: 300mA; Q Factor: 12; Test Frequency: 100MHz; DC Resistance (DCR): 800mR; Shielding: Unshielded; Self Resonant Frequency: 1GHz; Termination: SMD/SMT; Mount: Surface Mount; Case Code (Imperial): 0603; Height: 0.031inch; Tolerance: 5%; Inductance Tolerance: 5%; Package Quantity: 4000; Width: 0.8mm; Length: 0.063inch; Inductance: 68nH; Depth: 0.95mm; Case Code (Metric): 1608; Max DC Current: 300mA; Case/Package: 0603; Military Standard: Not; Min Operating Temperature: -55°C; REACH SVHC: No SVHC; Number of Pins: 2; Max Operating Temperature: 85°C; Lead Free: Lead Free; Current Rating: 300mA; Radiation Hardening: No; Packaging: Tape and Reel
L5 L6 = CMP-06042-009351-1: Wire Wound RF Inductor 4.7nH ±0.1nH 750mA 0.07Ω 0402 (1005); Self Resonant Frequency: 8GHz; Tolerance: 2%; Core Material: Air; Test Frequency: 100MHz; DC Resistance (DCR): 70mR; Q Factor: 25; Current: 140mA; Shielding: Unshielded; Case Code (Metric): 1005; Packaging: Tape and Reel; Max DC Current: 750mA; Max Operating Temperature: 125°C; Inductance: 4.7nH; Height: 0.5mm; Length: 1mm; DC Current: 750mA; Case/Package: 0402; Termination: SMD/SMT; Depth: 0.7mm; Radiation Hardening: No; Military Standard: Not; Current Rating: 750mA; Mount: Surface Mount; Package Quantity: 10000; Min Operating Temperature: -55°C; Lead Free: Lead Free; Weight: 2.8E-05oz; REACH SVHC: No SVHC; Width: 0.02inch; Case Code (Imperial): 0402
L7 L9 = CMP-06042-014117-1: Multilayer type RF Inductor 10nH ±5% 0.26Ω 500mA 0402; DC Resistance (DCR): 260mR; DC Current: 300mA; Shielding: Unshielded; Q Factor: 8; Test Frequency: 100MHz; Self Resonant Frequency: 3.4GHz; Core Material: Air; Width: 0.5mm; Radiation Hardening: No; Packaging: Tape and Reel; Lead Free: Lead Free; Military Standard: Not; Case/Package: 0402; Current Rating: 300mA; Case Code (Metric): 1005; Length: 0.039inch; Termination: SMD/SMT; Max DC Current: 300mA; Max Operating Temperature: 125°C; Mount: Surface Mount; Height - Seated (Max): 0.022inch; Package Quantity: 10000; Height: 0.5mm; Inductance: 10nH; Tolerance: 5%; Case Code (Imperial): 0402; Depth: 0.55mm; Min Operating Temperature: -55°C
L8 L10 = CMP-14484-000337-1: SMD Inductors 15uH ±10% 0.32A 1.69Ω 0805; DC Resistance (DCR): 1.69R; Max DC Current: 170mA; Test Frequency: 2.52MHz; Shielding: Unshielded; Current Rating: 320mA; Core Material: Ferrite; Mount: Surface Mount; Number of Pins: 2; Depth: 1.45mm; Lead Free: Lead Free; Max Operating Temperature: 105°C; Width: 0.049inch; Packaging: Tape and Reel; Package Quantity: 3000; Height - Seated (Max): 0.057inch; Inductance: 15uH; Halogen Free: Halogen Free; Height: 0.9mm; Termination: SMD/SMT; Tolerance: 10%; RoHS Compliant: Yes; Case Code (Imperial): 0805; Series: CB; Min Operating Temperature: -40°C; Resistor Type: Wirewound; Self Resonant Frequency: 28MHz; Radiation Hardening: No; Case Code (Metric): 2012; Length: 0.079inch; Saturation Current: 170mA; Case/Package: 0805
R16 R18 R19 = CMP-2001-04375-5: Chip Resistor, 1 KOhm, +/- 1%, 0.125 W, -55 to 155 degC, 0805 (2012 Metric), RoHS, Tape and Reel; Manufacturer: Panasonic; Voltage Rating: 150 V; ComponentLink1URL: http://www.panasonic.com/; ComponentLink2Description: Datasheet; REACH SVHC: Yes; ComponentLink1Description: Manufacturer URL; Length: 2 mm; Height: 0.6 mm; Package Quantity: 1; PackageDescription: 2-Pin Surface Mount Device, Body 2 x 1.25 mm; Packaging: Cut Tape; PackageReference: 0805; Max Operating Temperature: 155 degC; Mounting Technology: Surface Mount; ComponentLink2URL: http://industrial.panasonic.com/cdbs/www-data/pdf/RDA0000/AOA0000C86.pdf; DatasheetVersion: 04/2015; Min Operating Temperature: -55 degC; RoHSCompliant: true; Mount: Surface Mount
R17 R20 = CMP-2000-00335-2: Chip Resistor, 220 Ohm, +/- 1%, 0.1 W, -55 to 155 degC, 0603 (1608 Metric), RoHS, Tape and Reel; Voltage Rating: 50 V; Resistance: 22 Ohm; Power Rating: 100 mW; Case\Package: 0603; ComponentLink2Description: Datasheet; PackageDescription: 2-Pin Surface Mount Device, Body 1.6 x 0.85 mm; PackageReference: 0603; ComponentLink1Description: Manufacturer URL; ComponentLink2URL: http://industrial.panasonic.com/cdbs/www-data/pdf/RDA0000/AOA0000C86.pdf; Height: 0.45 mm; Mount: Surface Mount; Case Code (Metric): 1608; Pins: 2; Width: 0.8 mm; Length: 1.6 mm; Package Quantity: 5000; Tolerance: 1%; ComponentLink1URL: http://www.panasonic.com/; Max Operating Temperature: 155 degC; Min Operating Temperature: -55 degC; RoHSCompliant: true; Packaging: Tape and Reel; Case Code (Imperial): 0603; DatasheetVersion: Apr-15; REACH SVHC: No SVHC; Voltage Rating (DC): 50 V
Y1 = ECS-TXO-25CSMV-320-DY-TR: Package: None; Price: None; Value: *; MP: ECS-TXO-25CSMV-320-DY-TR; Availability: Unavailable